# Altium schematic sheet PowerTowerConnectors.SchDoc
size A4; Author: Timo Wilfling; Address1: TH Nürnberg; Address2: Georg Simon Ohm; Address3: Kesslerplatz 10; Address4: 90489 Nürnberg; SheetNumber: 3; SheetTotal: 8
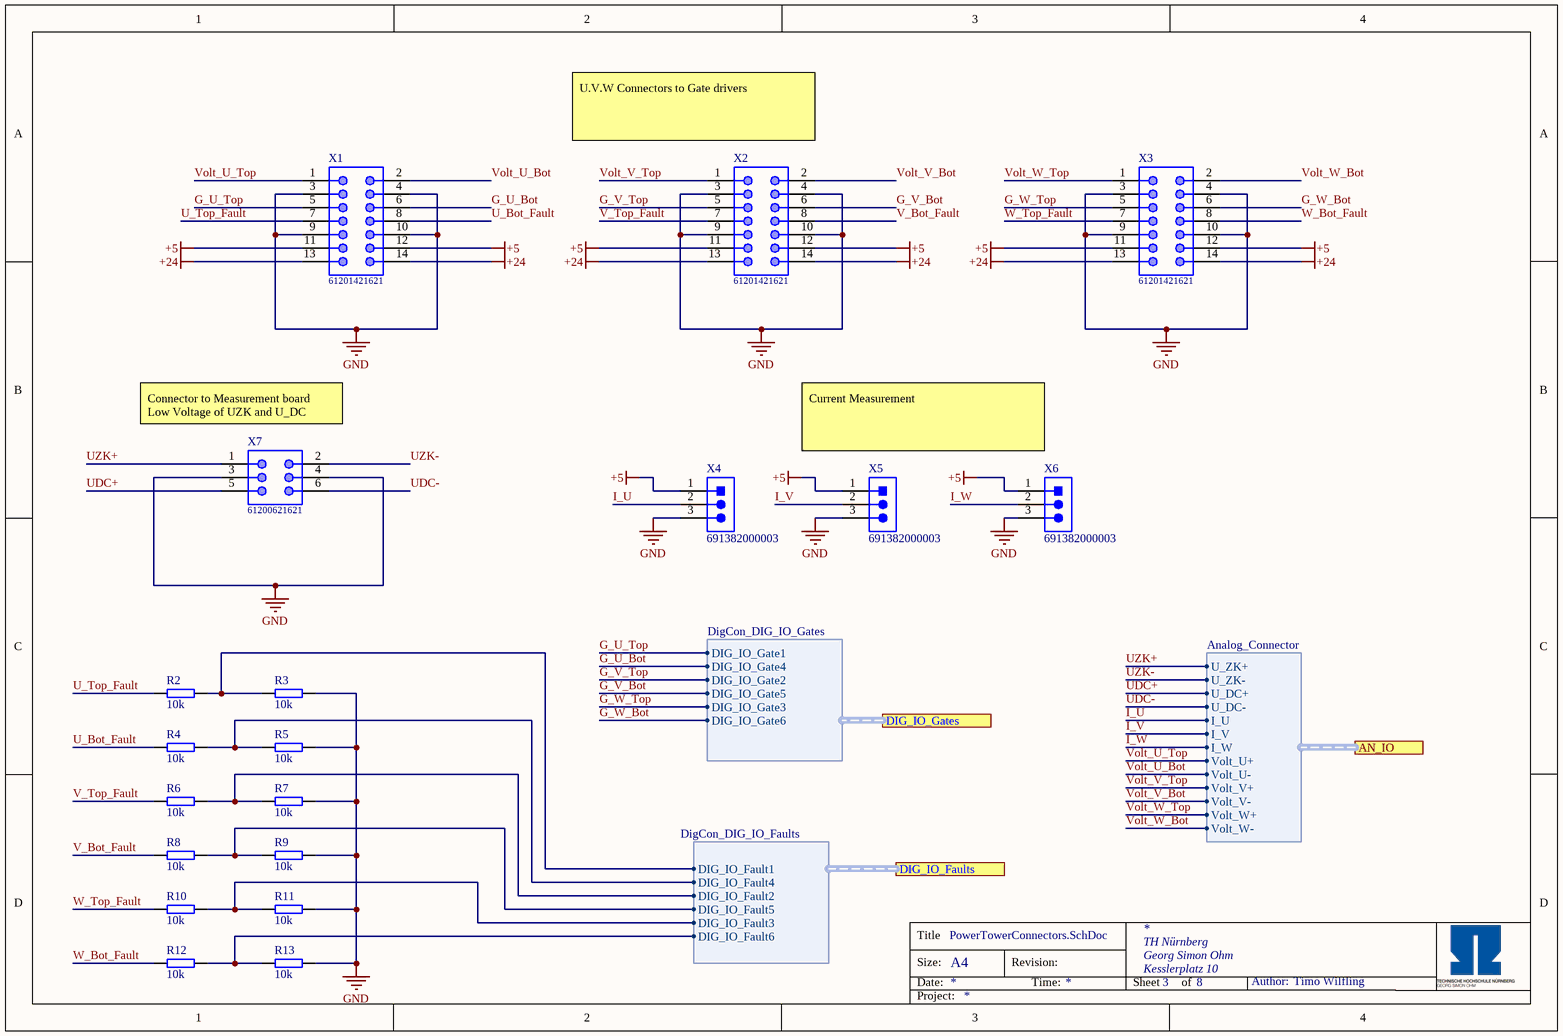
[diagram p0: PowerTowerConnectors.SchDoc]

## Parts
R2  10k  [RES 0603_1608]
R3  10k  [RES 0603_1608]
R4  10k  [RES 0603_1608]
R5  10k  [RES 0603_1608]
R6  10k  [RES 0603_1608]
R7  10k  [RES 0603_1608]
R8  10k  [RES 0603_1608]
R9  10k  [RES 0603_1608]
R10  10k  [RES 0603_1608]
R11  10k  [RES 0603_1608]
R12  10k  [RES 0603_1608]
R13  10k  [RES 0603_1608]
X1  61201421621  [61201421621]
X2  61201421621  [61201421621]
X3  61201421621  [61201421621]
X4  691382000003  [691382000003]
X5  691382000003  [691382000003]
X6  691382000003  [691382000003]
X7  61200621621  [61200621621]

## Ports
AN_IO (harness Analog_Connector), DIG_IO_Faults (harness DigCon_DIG_IO_Faults), DIG_IO_Gates (harness DigCon_DIG_IO_Gates)

## Harnesses
DigCon_DIG_IO_Gates: DIG_IO_Gate1, DIG_IO_Gate4, DIG_IO_Gate2, DIG_IO_Gate5, DIG_IO_Gate3, DIG_IO_Gate6
Analog_Connector: U_ZK+, U_ZK-, U_DC+, U_DC-, I_V, I_U, I_W, Volt_U+, Volt_U-, Volt_V-, Volt_V+, Volt_W+, Volt_W-
DigCon_DIG_IO_Faults: DIG_IO_Fault1, DIG_IO_Fault4, DIG_IO_Fault2, DIG_IO_Fault5, DIG_IO_Fault3, DIG_IO_Fault6

## Nets
+5: X1.11 X1.12 X2.11 X2.12 X3.11 X3.12 X4.1 X5.1 X6.1
+24: X1.13 X1.14 X2.13 X2.14 X3.13 X3.14
GND: R3.2 R5.2 R7.2 R9.2 R11.2 R13.2 X1.3 X1.4 X1.9 X1.10 X2.3 X2.4 X2.9 X2.10 X3.3 X3.4 X3.9 X3.10 X4.3 X5.3 X6.3 X7.3 X7.4
G_U_Bot: X1.6 ; port DIG_IO_Gates.DIG_IO_Gate4
G_U_Top: X1.5 ; port DIG_IO_Gates.DIG_IO_Gate1
G_V_Bot: X2.6 ; port DIG_IO_Gates.DIG_IO_Gate5
G_V_Top: X2.5 ; port DIG_IO_Gates.DIG_IO_Gate2
G_W_Bot: X3.6 ; port DIG_IO_Gates.DIG_IO_Gate6
G_W_Top: X3.5 ; port DIG_IO_Gates.DIG_IO_Gate3
I_U: X4.2 ; port AN_IO.I_U
I_V: X5.2 ; port AN_IO.I_V
I_W: X6.2 ; port AN_IO.I_W
U_Bot_Fault: R4.1 X1.8
U_Top_Fault: R2.1 X1.7
UDC+: X7.5 ; port AN_IO.U_DC+
UDC-: X7.6 ; port AN_IO.U_DC-
UZK+: X7.1 ; port AN_IO.U_ZK+
UZK-: X7.2 ; port AN_IO.U_ZK-
V_Bot_Fault: R8.1 X2.8
V_Top_Fault: R6.1 X2.7
Volt_U_Bot: X1.2 ; port AN_IO.Volt_U-
Volt_U_Top: X1.1 ; port AN_IO.Volt_U+
Volt_V_Bot: X2.2 ; port AN_IO.Volt_V-
Volt_V_Top: X2.1 ; port AN_IO.Volt_V+
Volt_W_Bot: X3.2 ; port AN_IO.Volt_W-
Volt_W_Top: X3.1 ; port AN_IO.Volt_W+
W_Bot_Fault: R12.1 X3.8
W_Top_Fault: R10.1 X3.7
NetR2_2: R2.2 R3.1 ; port DIG_IO_Faults.DIG_IO_Fault1
NetR4_2: R4.2 R5.1 ; port DIG_IO_Faults.DIG_IO_Fault4
NetR6_2: R6.2 R7.1 ; port DIG_IO_Faults.DIG_IO_Fault2
NetR8_2: R8.2 R9.1 ; port DIG_IO_Faults.DIG_IO_Fault5
NetR10_2: R10.2 R11.1 ; port DIG_IO_Faults.DIG_IO_Fault3
NetR12_2: R12.2 R13.1 ; port DIG_IO_Faults.DIG_IO_Fault6

## Notes on the sheet
- (near X2) U.V.W Connectors to Gate drivers
- (near X7) Connector to Measurement board
  Low Voltage of UZK and U_DC
- Current Measurement
- Title
- Size:
- Date:
- A4
- Revision:
- Time:
- Sheet
- of
- Author:
- Project:

## Library data of the parts
R2-R13 = RK73B1JTTD103J: SMD resistor E24 series; Manufacturer: KOA Speer; Tolerance: 5%; Created from: MGremer; Manufacturer Part Number: RK73B1JTTD103J; PartID: 98; Created On: 14.12.2020 16:17:14; ComponentLink1Description: Datasheet; ComponentLink1URL: https://www.mouser.de/datasheet/2/219/RK73B-1825463.pdf; Component Type: SMD resistor; Device Package: 0603; Last Updated: 02.03.2021 14:07:32; Mounting Type: SMD; Supplier 1: Mouser; Supplier Part Number 1: 660-RK73B1JTTD103J; Type: Resistor; Value: 10k; Live Cycle Status: 1; Stock number: Labor SMD Container
X1-X3 = 61201421621: 2.54mm Double Row 14-pol Vertical Male Pin Box Header; Manufacturer: Wurth; Created from: TWilfling; Number of positions: 14; Manufacturer Part Number: 61201421621; PartID: 45; Created On: 29.04.2021 14:12:30; ComponentLink1Description: Homepage; ComponentLink1URL: https://www.we-online.de/katalog/de/BHD_2_54_MALE_BOX_HEADER_6120XX21621?sq=61201421621#61201421621; ComponentLink2Description: Datasheet; ComponentLink2URL: https://www.we-online.de/katalog/datasheet/61201421621.pdf; Component Type: Wurth Connector; Device Package: Connector; Last Updated: 29.04.2021 14:52:34; Mounting Type: THT; Supplier 1: Wurth; Supplier Part Number 1: 61201421621; Type: Connector; Live Cycle Status: 1; Number of rows: 2; Stock number: not stored
X4-X6 = 691382000003: 2.5mm Single Row 3-pol Vertical PCB Header; Manufacturer: Wurth; Created from: TWilfling; Number of positions: 3; Manufacturer Part Number: 691382000003; PartID: 47; Created On: 29.04.2021 14:24:57; ComponentLink1Description: Homepage; ComponentLink1URL: https://www.we-online.de/katalog/de/TBL_2_50_382_VERTICAL_PCB_HEADER_69138200000X?sq=691382000003#691382000003; ComponentLink2Description: Datasheet; ComponentLink2URL: https://www.we-online.de/katalog/datasheet/691382000003.pdf; Component Type: Wurth Connector; Device Package: Connector; Last Updated: 29.04.2021 14:52:34; Mounting Type: THT; Supplier 1: Wurth; Supplier Part Number 1: 691382000003; Type: Connector; Live Cycle Status: 1; Number of rows: 1; Stock number: not stored
X7 = 61200621621: 2.54mm Double Row 6-pol Vertical Male Pin Box Header; Manufacturer: Wurth; Created from: TWilfling; Number of positions: 6; Manufacturer Part Number: 61200621621; PartID: 44; Created On: 29.04.2021 13:51:54; ComponentLink1Description: Homepage; ComponentLink1URL: https://www.we-online.de/katalog/de/BHD_2_54_MALE_BOX_HEADER_6120XX21621?sq=61200621621#61200621621; ComponentLink2Description: Datasheet; ComponentLink2URL: https://www.we-online.de/katalog/datasheet/61200621621.pdf; Component Type: Wurth Connector; Device Package: Connector; Last Updated: 29.04.2021 14:52:34; Mounting Type: THT; Supplier 1: Wurth; Supplier Part Number 1: 61200621621; Type: Connector; Live Cycle Status: 1; Number of rows: 2; Stock number: not stored